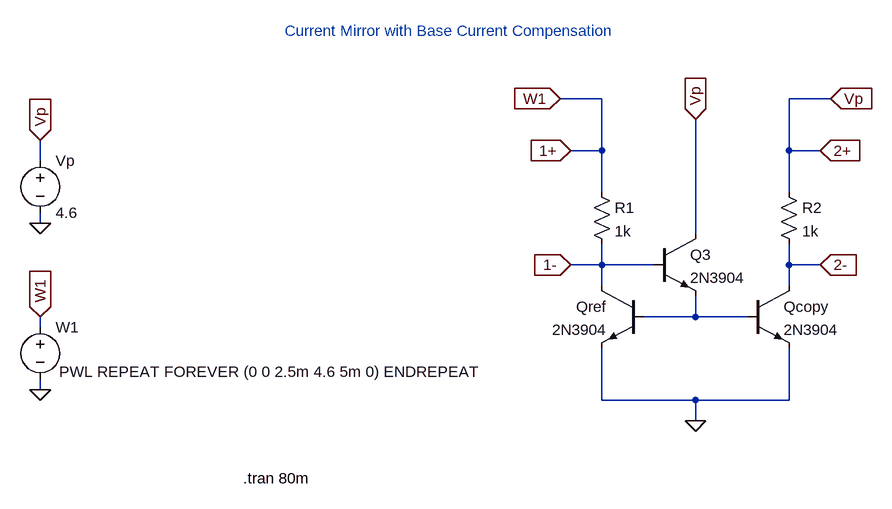
[diagram p0: schematic bjt_mirror_beta_helper.asc]
bjt_mirror_beta_helper.asc, the LTspice schematic file:
Version 4
SHEET 1 2016 1044
WIRE -208 -64 -272 -64
WIRE 144 -64 80 -64
WIRE -208 16 -208 -64
WIRE -208 16 -256 16
WIRE 80 16 80 -64
WIRE 128 16 80 16
WIRE -1072 32 -1072 0
WIRE -208 80 -208 16
WIRE 80 80 80 16
WIRE -1072 128 -1072 112
WIRE -64 144 -64 -32
WIRE -208 192 -208 160
WIRE -208 192 -256 192
WIRE -128 192 -208 192
WIRE 80 192 80 160
WIRE 128 192 80 192
WIRE -208 224 -208 192
WIRE 80 224 80 192
WIRE -64 272 -64 240
WIRE -64 272 -144 272
WIRE 16 272 -64 272
WIRE -1072 288 -1072 272
WIRE -1072 384 -1072 368
WIRE -208 400 -208 320
WIRE -64 400 -208 400
WIRE 80 400 80 320
WIRE 80 400 -64 400
WIRE -64 432 -64 400
FLAG -1072 384 0
FLAG -1072 272 W1
IOPIN -1072 272 In
FLAG -64 432 0
FLAG -272 -64 W1
IOPIN -272 -64 In
FLAG 144 -64 Vp
IOPIN 144 -64 In
FLAG -256 16 1+
IOPIN -256 16 In
FLAG -256 192 1-
IOPIN -256 192 In
FLAG 128 16 2+
IOPIN 128 16 In
FLAG 128 192 2-
IOPIN 128 192 In
FLAG -64 -32 Vp
IOPIN -64 -32 In
FLAG -1072 128 0
FLAG -1072 0 Vp
IOPIN -1072 0 In
SYMBOL voltage -1072 272 R0
WINDOW 3 29 84 Left 2
WINDOW 123 0 0 Left 0
WINDOW 39 0 0 Left 0
SYMATTR Value PWL REPEAT FOREVER (0 0 2.5m 4.6 5m 0) ENDREPEAT
SYMATTR InstName W1
SYMBOL res -224 64 R0
SYMATTR InstName R1
SYMATTR Value 1k
SYMBOL res 64 64 R0
SYMATTR InstName R2
SYMATTR Value 1k
SYMBOL npn -144 224 M0
SYMATTR InstName Qref
SYMATTR Value 2N3904
SYMBOL npn 16 224 R0
SYMATTR InstName Qcopy
SYMATTR Value 2N3904
SYMBOL npn -128 144 R0
SYMATTR InstName Q3
SYMATTR Value 2N3904
SYMBOL voltage -1072 16 R0
SYMATTR InstName Vp
SYMATTR Value 4.6
TEXT -696 -168 Left 2 ;Current Mirror with Base Current Compensation
TEXT -760 520 Left 2 !.tran 80m

The netlist it stands for:
* bjt_mirror_beta_helper.asc
V§W1 1+ 0 PWL REPEAT FOREVER (0 0 2.5m 4.6 5m 0) ENDREPEAT
R1 1+ 1- 1k
R2 2+ 2- 1k
Qref 1- N001 0 0 2N3904
Qcopy 2- N001 0 0 2N3904
Q3 2+ 1- N001 0 2N3904
Vp 2+ 0 4.6
.model NPN NPN
.model PNP PNP
.lib standard.bjt
* Current Mirror with Base Current Compensation
.tran 80m
.backanno
.end